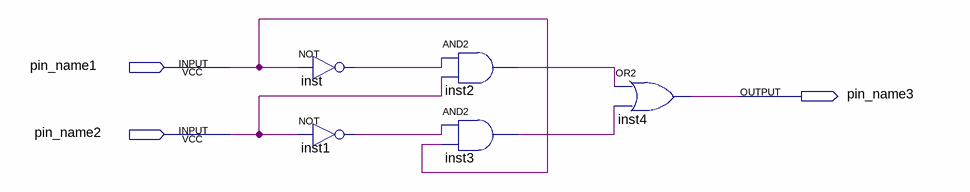
[diagram p0: schematic sheet]
// Quartus schematic c0.bdf as structural Verilog: 5 symbols, 3 pins
module c0 (
  input  pin_name1,
  input  pin_name2,
  output pin_name3
);

  wire inst1_out, inst2_out, inst3_out, inst_out;

  not inst (inst_out, pin_name1);
  not inst1 (inst1_out, pin_name2);
  and inst2 (inst2_out, inst_out, pin_name2);
  and inst3 (inst3_out, inst1_out, pin_name1);
  or inst4 (pin_name3, inst2_out, inst3_out);
endmodule
